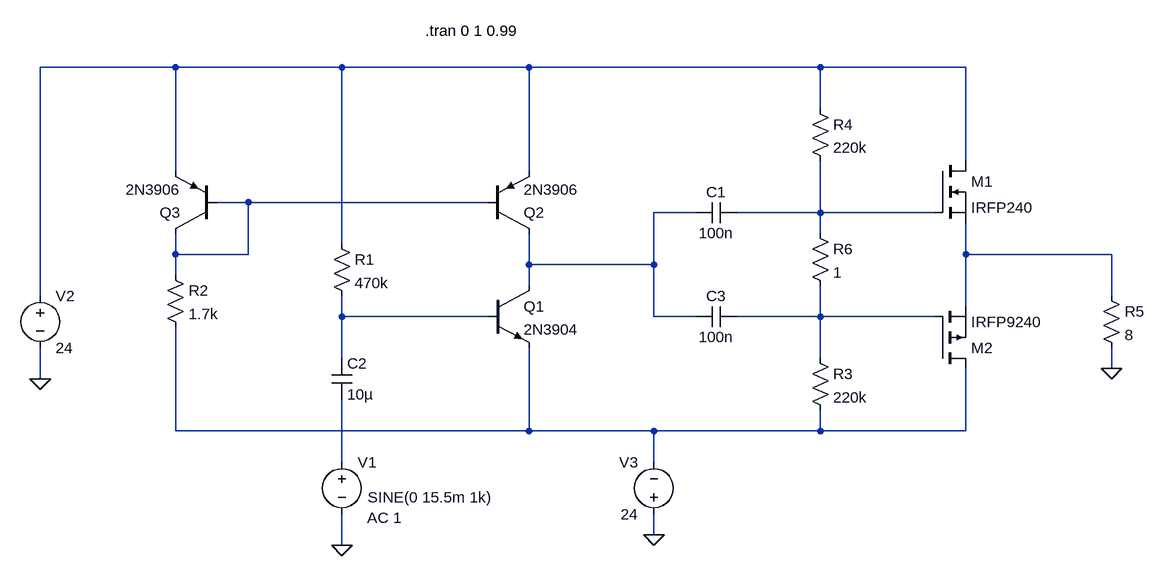
[diagram p0: schematic Class B Power Amplifier.asc]
Class B Power Amplifier.asc, the LTspice schematic file:
Version 4
SHEET 1 1736 680
WIRE 240 -224 32 -224
WIRE 496 -224 240 -224
WIRE 784 -224 496 -224
WIRE 1232 -224 784 -224
WIRE 1456 -224 1232 -224
WIRE 1232 -160 1232 -224
WIRE 1456 -80 1456 -224
WIRE 240 -64 240 -224
WIRE 784 -64 784 -224
WIRE 352 -16 304 -16
WIRE 720 -16 352 -16
WIRE 1040 0 976 0
WIRE 1232 0 1232 -80
WIRE 1232 0 1104 0
WIRE 1408 0 1232 0
WIRE 1232 32 1232 0
WIRE 496 48 496 -224
WIRE 240 64 240 32
WIRE 352 64 352 -16
WIRE 352 64 240 64
WIRE 1456 64 1456 16
WIRE 1680 64 1456 64
WIRE 784 80 784 32
WIRE 976 80 976 0
WIRE 976 80 784 80
WIRE 240 96 240 64
WIRE 784 112 784 80
WIRE 32 128 32 -224
WIRE 1680 128 1680 64
WIRE 1456 144 1456 64
WIRE 496 160 496 128
WIRE 720 160 496 160
WIRE 976 160 976 80
WIRE 1040 160 976 160
WIRE 1232 160 1232 112
WIRE 1232 160 1104 160
WIRE 1408 160 1232 160
WIRE 496 224 496 160
WIRE 1232 224 1232 160
WIRE 1680 240 1680 208
WIRE 32 256 32 208
WIRE 240 336 240 176
WIRE 784 336 784 208
WIRE 784 336 240 336
WIRE 976 336 784 336
WIRE 1232 336 1232 304
WIRE 1232 336 976 336
WIRE 1456 336 1456 240
WIRE 1456 336 1232 336
WIRE 496 384 496 288
WIRE 976 384 976 336
WIRE 976 496 976 464
WIRE 496 512 496 464
FLAG 976 496 0
FLAG 496 512 0
FLAG 32 256 0
FLAG 1680 240 0
SYMBOL voltage 32 112 R0
SYMATTR InstName V2
SYMATTR Value 24
SYMBOL pnp 304 32 R180
SYMATTR InstName Q3
SYMATTR Value 2N3906
SYMBOL res 224 80 R0
SYMATTR InstName R2
SYMATTR Value 1.7k
SYMBOL res 480 32 R0
SYMATTR InstName R1
SYMATTR Value 470k
SYMBOL cap 480 224 R0
SYMATTR InstName C2
SYMATTR Value 10µ
SYMATTR SpiceLine Rser=100
SYMBOL voltage 496 368 R0
WINDOW 123 39 102 Left 2
WINDOW 39 0 0 Left 0
WINDOW 3 40 70 Left 2
SYMATTR Value2 AC 1
SYMATTR Value SINE(0 15.5m 1k)
SYMATTR InstName V1
SYMBOL npn 720 112 R0
SYMATTR InstName Q1
SYMATTR Value 2N3904
SYMBOL pnp 720 32 M180
SYMATTR InstName Q2
SYMATTR Value 2N3906
SYMBOL cap 1104 -16 R90
WINDOW 0 0 32 VBottom 2
WINDOW 3 32 32 VTop 2
SYMATTR InstName C1
SYMATTR Value 100n
SYMBOL cap 1104 144 R90
WINDOW 0 0 32 VBottom 2
WINDOW 3 32 32 VTop 2
SYMATTR InstName C3
SYMATTR Value 100n
SYMBOL res 1216 -176 R0
SYMATTR InstName R4
SYMATTR Value 220k
SYMBOL res 1216 16 R0
SYMATTR InstName R6
SYMATTR Value 1
SYMBOL res 1216 208 R0
SYMATTR InstName R3
SYMATTR Value 220k
SYMBOL voltage 976 480 R180
WINDOW 0 24 96 Left 2
WINDOW 3 24 16 Left 2
SYMATTR InstName V3
SYMATTR Value 24
SYMBOL nmos 1408 -80 R0
SYMATTR InstName M1
SYMATTR Value IRFP240
SYMBOL pmos 1408 240 M180
SYMATTR InstName M2
SYMATTR Value IRFP9240
SYMBOL res 1664 112 R0
SYMATTR InstName R5
SYMATTR Value 8
TEXT 624 -280 Left 2 !.tran 0 1 0.99

The netlist it stands for:
* Class B Power Amplifier.asc
V2 N001 0 24
Q3 N002 N002 N001 0 2N3906
R2 N002 N008 1.7k
R1 N001 N006 470k
C2 N006 N009 10µ Rser=100
V1 N009 0 SINE(0 15.5m 1k) AC 1
Q1 N003 N006 N008 0 2N3904
Q2 N003 N002 N001 0 2N3906
C1 N004 N003 100n
C3 N007 N003 100n
R4 N001 N004 220k
R6 N004 N007 1
R3 N007 N008 220k
V3 0 N008 24
M1 N001 N004 N005 N005 IRFP240
M2 N008 N007 N005 N005 IRFP9240
R5 N005 0 8
.model NPN NPN
.model PNP PNP
.lib standard.bjt
.model NMOS NMOS
.model PMOS PMOS
.lib standard.mos
.tran 0 1 0.99
.backanno
.end